# EAGLE design PowerMinder1sch (EAGLE 6.5.0)
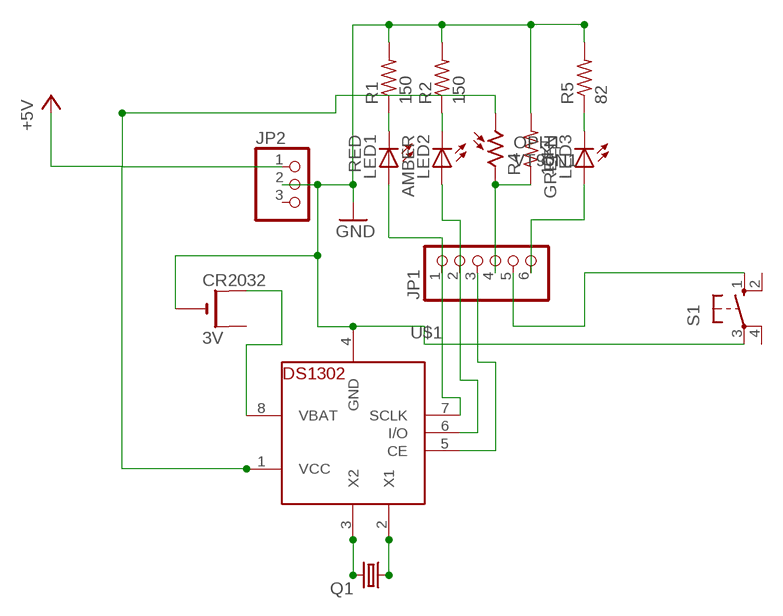
[diagram p0: schematic, sheet 1]

## Parts
CR2032  3V  CR2032THM  [CR2032-THRU]
JP1  PINHD-1X6  [1X06]
JP2  PINHD-1X3  [1X03]
LED1  RED  LED5MM  [LED5MM]
LED2  AMBER  LED5MM  [LED5MM]
LED3  GREEN  LED5MM  [LED5MM]
OPH1  VT90N1  [VT900]
Q1  CRYSTALTC26H  [TC26H]
R1  150  R-US_0207/12  [0207/12]
R2  150  R-US_0207/12  [0207/12]
R4  10K  R-US_0207/12  [0207/12]
R5  82  R-US_0207/12  [0207/12]
S1  10-XX  [B3F-10XX]
U$1  DS1302  [DIL08-ROUND]

## Nets
+5V: JP2.1 OPH1.1 U$1.1(VCC)
GND: CR2032.- JP2.2 R1.2 R2.2 R4.2 R5.2 S1.3(P) U$1.4(GND)
N$1: JP1.1 LED1.A U$1.7(SCLK)
N$2: JP1.2 LED2.A U$1.6(I/O)
N$3: JP1.4 OPH1.2 R4.1
N$4: JP1.6 LED3.A
N$5: LED1.K(C) R1.1
N$6: LED2.K(C) R2.1
N$7: LED3.K(C) R5.1
N$8: Q1.1 U$1.2(X1)
N$9: Q1.2 U$1.3(X2)
N$10: CR2032.+1(+) U$1.8(VBAT)
N$11: JP1.5 S1.1(S)
N$12: JP1.3 U$1.5(CE)
Unconnected: CR2032.+2(+1) JP2.3 S1.2(S1) S1.4(P1)

## Library data of the parts
CR2032 = adafruit:CR2032
JP1 = adafruit:PINHD-1X6: PIN HEADER
JP2 = adafruit:PINHD-1X3: PIN HEADER
LED1-LED3 = adafruit:LED: LED OSRAM: - CHIPLED LG R971, LG N971, LY N971, LG Q971, LY Q971, LO R971, LY R971 LH N974, LH R974 LS Q976, LO Q976, LY Q976 LO Q996 - Hyper CHIPLED LW Q18S LB Q993, LB Q99A, LB R99A - SideLED LS A670, LO A670, LY A670, LG A670, LP A670 LB A673, LV A673, LT A673, LW A673 LH A674 LY A675 LS A676, LA A676, LO A676, LY A676, LW A676 LS A679, LY A679, LG A679 - Hyper Micro SIDELED® LS Y876, LA Y876, LO Y876, LY Y876 LT Y87S - SmartLED LW L88C, LW L88S LB L89C, LB L89S, LG L890 LS L89K, LO L89K, LY L89K LS L896, LA L896, LO L896, LY L896 - TOPLED LS T670, LO T670, LY T670, LG T670, LP T670 LSG T670, LSP T670, LSY T670, LOP T670, LYG T670 LG T671, LOG T671, LSG T671 LB T673, LV T673, LT T673, LW T673 LH T674 LS T676, LA T676, LO T676, LY T676, LB T676, LH T676, LSB T676, LW T676 LB T67C, LV T67C, LT T67C, LS T67K, LO T67K, LY T67K, LW E67C LS E67B, LA E67B, LO E67B, LY E67B, LB E67C, LV E67C, LT E67C LW T67C LS T679, LY T679, LG T679 LS T770, LO T770, LY T770, LG T770, LP T770 LB T773, LV T773, LT T773, LW T773 LH T774 LS E675, LA E675, LY E675, LS T675 LS T776, LA T776, LO T776, LY T776, LB T776 LHGB T686 LT T68C, LB T68C - Hyper Mini TOPLED® LB M676 - Mini TOPLED Santana® LG M470 LS M47K, LO M47K, LY M47K Source: http://www.osram.convergy.de/
OPH1 = photo-elements:VT9: Photoconductive Cell VT900 Series Source: http://optoelectronics.perkinelmer.com/content/Datasheets/DTS_vt900seriesdatasheet.pdf
Q1 = adafruit:CRYSTAL: CRYSTAL; OC_FARNELL: unknown; OC_NEWARK: unknown
R1 R2 R4 R5 = adafruit:R-US_: RESISTOR, American symbol
S1 = switch-omron:10-XX: OMRON SWITCH; MPN: B3F-1000; OC_FARNELL: 176432; OC_NEWARK: 36M3542
U$1 = adafruit:DS1302: DS1302 - Real time clock with supercap trickle charger

## Board
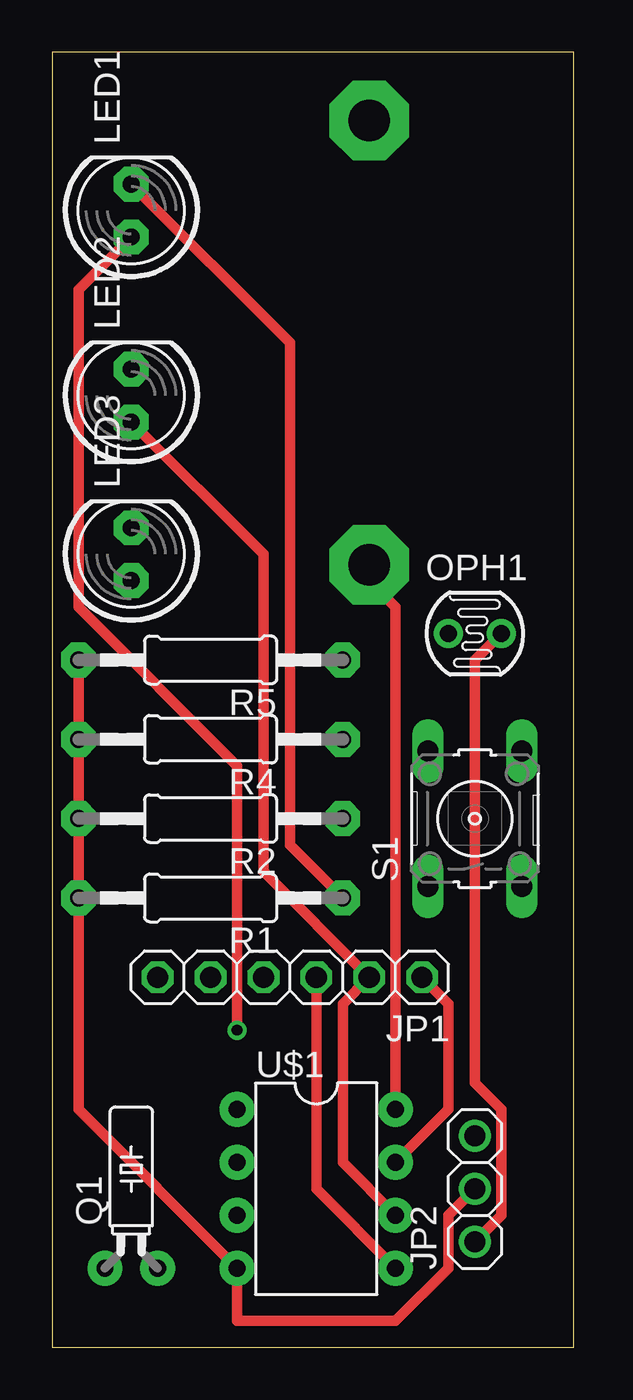
[diagram p1: board, top side]
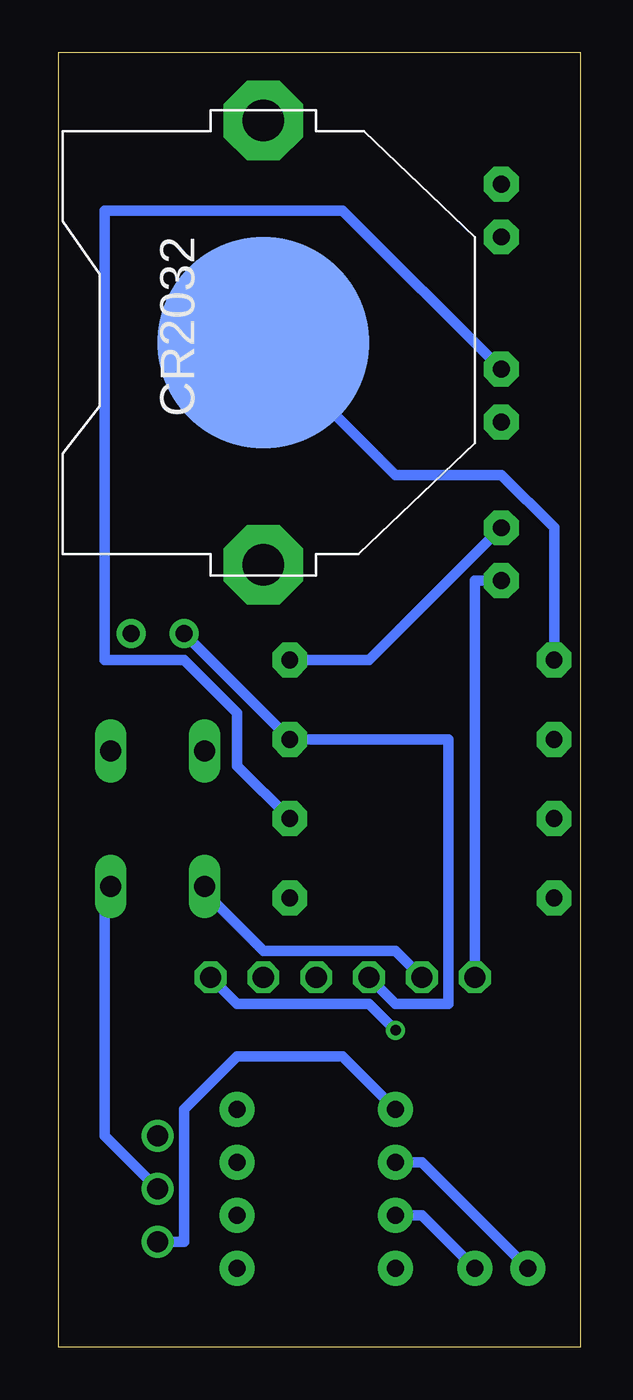
[diagram p2: board, bottom side, seen from below]

Size 25.07 x 62.22 mm. Coordinates in mm from the lower left corner, seen from the top.
Outline: 0,0 25.07,0 25.07,62.22 0,62.22 0,0
Copper layers (1*16): Top 0.035mm / dielectric 1.5mm / Bottom 0.035mm
Design rules "default *": minimum track width 20mil, minimum drill 20mil, track to track 8mil, track to pad 8mil, pad to pad 8mil, via to via 8mil, smd to smd 8mil, copper to edge 40mil, drill to drill 8mil, minimum pad ring 10mil, minimum via ring 8mil, stop-mask expansion 4mil, vias tented up to drill 0mil, thermal gap 10mil

### Footprints (pad centres in the part's own frame; a part is rotated, then mirrored left to right if it is on the bottom)
CR2032-THRU = drill 2 pad 3.81 octagon: +1 -10.668,0; +2 10.668,0 | smd 10.16 x 10.16: - 0,0
1X06 = drill 1.016 octagon: 1 -6.35,0; 2 -3.81,0; 3 -1.27,0; 4 1.27,0; 5 3.81,0; 6 6.35,0
1X03 = drill 1.016: 1 -2.54,0; 2 0,0; 3 2.54,0
LED5MM = drill 0.813 pad 1.676 octagon: A -1.27,0; K 1.27,0
VT900 = drill 0.8 pad 1.4: 1 -1.27,0; 2 1.27,0
TC26H = drill 0.813 pad 1.676: 1 -1.27,0; 2 1.27,0
0207/12 = drill 0.813 pad 1.676 octagon: 1 -6.35,0; 2 6.35,0
B3F-10XX = drill 1.016 long: 1 -3.251,2.261; 2 3.251,2.261; 3 -3.251,-2.261; 4 3.251,-2.261
DIL08-ROUND = drill 0.813 pad 1.676: 1 -3.81,-3.81; 2 -1.27,-3.81; 3 1.27,-3.81; 4 3.81,-3.81; 5 3.81,3.81; 6 1.27,3.81; 7 -1.27,3.81; 8 -3.81,3.81

### Placement (x,y rotation side)
CR2032  15.24,48.26 90 bottom
JP1  11.43,17.78 180 top
JP2  20.32,7.62 90 top
LED1  3.81,54.61 90 top
LED2  3.81,45.72 90 top
LED3  3.81,38.1 90 top
OPH1  20.32,34.29 180 top
Q1  3.81,3.81 0 top
R1  7.62,21.59 180 top
R2  7.62,25.4 180 top
R4  7.62,29.21 180 top
R5  7.62,33.02 180 top
S1  20.32,25.4 90 top
U$1  12.7,7.62 270 top

### Tracks (layer width: path | path; a pad name or v marks a point on that pad's centre or on a via)
+5V
  Top 0.508: OPH1.1 20.32,33.02 20.32,12.7 21.59,11.43 21.59,6.35 JP2.1
  Bottom 0.508: U$1.1 11.43,13.97 16.51,13.97 19.05,11.43 19.05,5.08 JP2.1
GND
  Top 0.508: R5.2 R4.2 R2.2 R1.2 1.27,11.43 U$1.4 8.89,1.27 16.51,1.27 19.05,3.81 19.05,6.35 JP2.2
  Bottom 0.508: JP2.2 22.86,10.16 22.86,21.59 S1.3 | CR2032.- 8.89,41.91 3.81,41.91 1.27,39.37 R5.2
N$1  (via drill 0.51)
  Top 0.508: JP1.1 19.05,16.51 19.05,11.43 U$1.7 | LED1.A 1.27,50.8 1.27,35.56 8.89,27.94 v8.89,15.24
  Bottom 0.508: v8.89,15.24 10.16,16.51 16.51,16.51 JP1.1
N$2
  Top 0.508: U$1.6 13.97,8.89 13.97,16.51 JP1.2 10.16,22.86 10.16,38.1 LED2.A
N$3
  Bottom 0.508: OPH1.2 R4.1 6.35,29.21 6.35,16.51 8.89,16.51 JP1.4
N$4
  Bottom 0.508: JP1.6 5.08,36.83 LED3.A
N$5
  Top 0.508: R1.1 11.43,24.13 11.43,48.26 LED1.K
N$6
  Bottom 0.508: R2.1 16.51,27.94 16.51,30.48 19.05,33.02 22.86,33.02 22.86,54.61 11.43,54.61 LED2.K
N$7
  Bottom 0.508: LED3.K 10.16,33.02 R5.1
N$8
  Bottom 0.508: Q1.1 7.62,8.89 U$1.2
N$9
  Bottom 0.508: Q1.2 7.62,6.35 U$1.3
N$10
  Top 0.508: U$1.8 16.51,35.56 15.24,36.83 CR2032.+1
N$11
  Bottom 0.508: JP1.5 8.89,19.05 15.24,19.05 17.78,21.59 S1.1
N$12
  Top 0.508: JP1.3 12.7,7.62 U$1.5